# EAGLE schematic HDA-v1.1 (EAGLE 8.2.1)
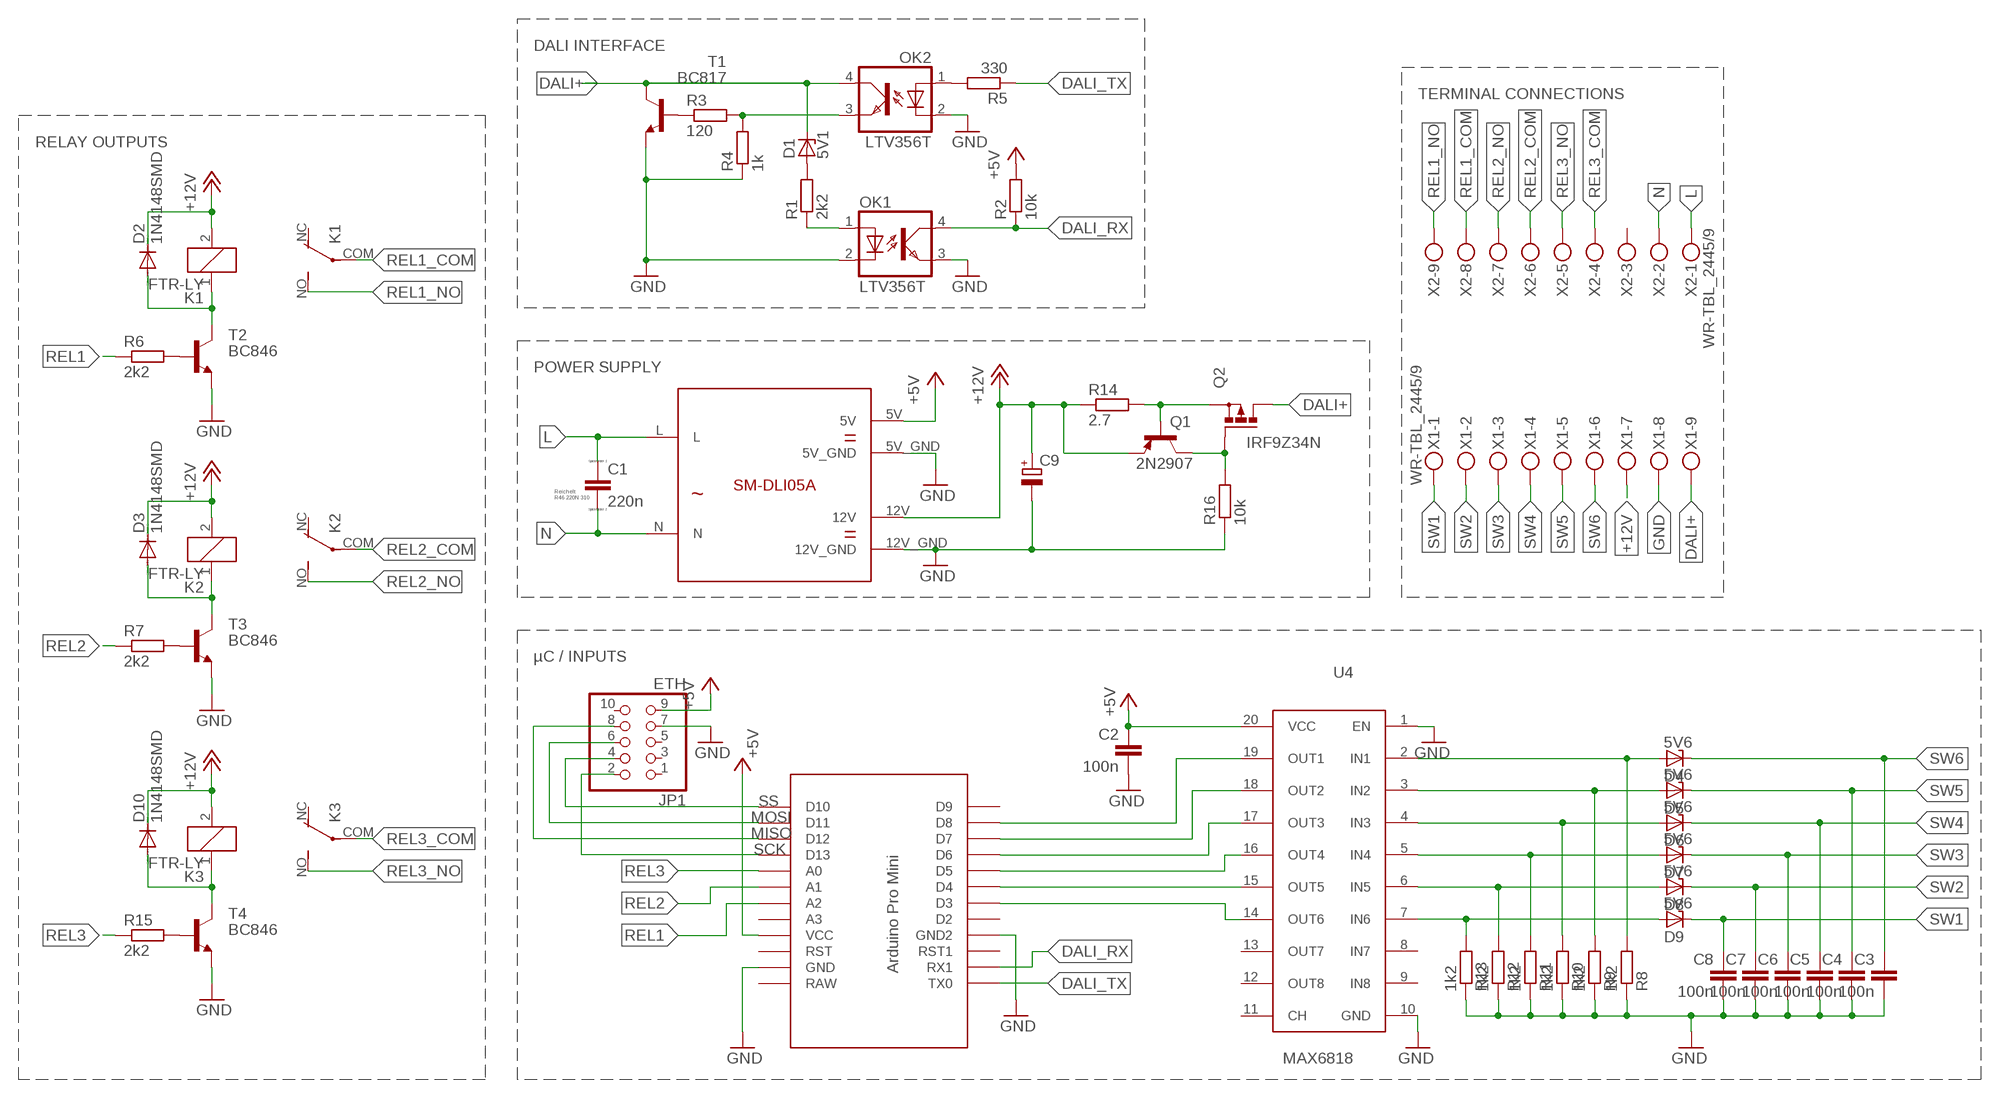
[diagram p0: schematic, sheet 1]

## Parts
C1  220n  X2_220N  [ECQUAAF224]
C2  100n  C-EUC1206K  [C1206K]
C3  100n  C-EUC1206K  [C1206K]
C4  100n  C-EUC1206K  [C1206K]
C5  100n  C-EUC1206K  [C1206K]
C6  100n  C-EUC1206K  [C1206K]
C7  100n  C-EUC1206K  [C1206K]
C8  100n  C-EUC1206K  [C1206K]
C9  CPOL-EUSMCE  [SMC_E]
D1  5V1  ZENER-DIODESOD80C  [SOD80C]
D2  1N4148SMD  DIODE-SOD80C  [SOD80C]
D3  1N4148SMD  DIODE-SOD80C  [SOD80C]
D4  5V6  ZENER-DIODESOD80C  [SOD80C]
D5  5V6  ZENER-DIODESOD80C  [SOD80C]
D6  5V6  ZENER-DIODESOD80C  [SOD80C]
D7  5V6  ZENER-DIODESOD80C  [SOD80C]
D8  5V6  ZENER-DIODESOD80C  [SOD80C]
D9  5V6  ZENER-DIODESOD80C  [SOD80C]
D10  1N4148SMD  DIODE-SOD80C  [SOD80C]
JP1  ETH  PINHD-2X5  [2X05]
K1  FTR-LY  PE3004H  [PE-FORM-C]
K2  FTR-LY  PE3004H  [PE-FORM-C]
K3  FTR-LY  PE3004H  [PE-FORM-C]
OK1  LTV356T  [SOP-4-2.54]
OK2  LTV356T  [SOP-4-2.54]
Q1  2N2907  MMBT2907ALT1SMD  [SOT23-BEC]
Q2  IRF9Z34N  PMOSFET_PTO220BV  [TO220BV]
R1  2k2  R-EU_R1206  [R1206]
R2  10k  R-EU_R1206  [R1206]
R3  120  R-EU_R1206  [R1206]
R4  1k  R-EU_R1206  [R1206]
R5  330  R-EU_R1206  [R1206]
R6  2k2  R-EU_R1206  [R1206]
R7  2k2  R-EU_R1206  [R1206]
R8  1k2  R-EU_R1206  [R1206]
R9  1k2  R-EU_R1206  [R1206]
R10  1k2  R-EU_R1206  [R1206]
R11  1k2  R-EU_R1206  [R1206]
R12  1k2  R-EU_R1206  [R1206]
R13  1k2  R-EU_R1206  [R1206]
R14  2.7  R-EU_R1206  [R1206]
R15  2k2  R-EU_R1206  [R1206]
R16  10k  R-EU_R1206  [R1206]
T1  BC817  BC817-40SMD  [SOT23-BEC]
T2  BC846  [SOT23]
T3  BC846  [SOT23]
T4  BC846  [SOT23]
U1  SM-DLI05A  [SM-DLI05A]
U2  ABK-PRO-MINI  [ABK-PRO-MINI]
U4  MAX6818  [SSOP20]
X1  WR-TBL_2445/9  [WR-TBL_2445/9]
X2  WR-TBL_2445/9  [WR-TBL_2445/9]

## Nets
+5V: C2.1 JP1.9 R2.2 U1.5V U2.VCC U4.20(VCC)
+12V: C9.+ D2.C D3.C D10.C K1.2 K2.2 K3.2 Q1.E R14.1 U1.12V X1.7
DALI+: D1.C OK2.4(COL) Q2.D T1.C X1.9
DALI_RX: OK1.4(COL) R2.1 U2.RX1
DALI_TX: R5.1 U2.TX0
GND: C2.2 C3.2 C4.2 C5.2 C6.2 C7.2 C8.2 C9.- JP1.7 OK1.2(C) OK1.3(EMIT) OK2.2(C) R4.1 R8.1 R9.1 R10.1 R11.1 R12.1 R13.1 R16.1 T1.E T2.2(E) T3.2(E) T4.2(E) U1.5V_GND U1.12V_GND U2.GND U2.GND1(GND2) U4.1(EN) U4.10(GND) X1.8
L: C1.1 U1.L X2.1
MISO: JP1.8 U2.D12
MOSI: JP1.6 U2.D11
N: C1.2 U1.N X2.2
N$1: D1.A R1.2
N$2: OK1.1(A) R1.1
N$3: Q1.B Q2.S R14.2
N$5: R3.1 T1.B
N$6: OK2.3(EMIT) R3.2 R4.2
N$7: Q1.C Q2.G R16.2
N$11: OK2.1(A) R5.2
N$19: R15.2 T4.1(B)
N$20: R6.2 T2.1(B)
N$21: R7.2 T3.1(B)
N$22: D3.A K2.1 T3.3(C)
N$23: D8.A R12.2 U4.6(IN5)
N$24: D2.A K1.1 T2.3(C)
N$25: D9.A R13.2 U4.7(IN6)
N$26: D4.A R8.2 U4.2(IN1)
N$27: D5.A R9.2 U4.3(IN2)
N$28: D6.A R10.2 U4.4(IN3)
N$29: D7.A R11.2 U4.5(IN4)
N$30: D10.A K3.1 T4.3(C)
N$31: U2.D5 U4.16(OUT4)
N$32: U2.D6 U4.17(OUT3)
N$33: U2.D7 U4.18(OUT2)
N$34: U2.D8 U4.19(OUT1)
N$35: U2.D4 U4.15(OUT5)
N$36: U2.D3 U4.14(OUT6)
REL1: R6.1 U2.A2
REL1_COM: K1.COM(2:P) X2.8
REL1_NO: K1.NO(2:S) X2.9
REL2: R7.1 U2.A1
REL2_COM: K2.COM(2:P) X2.6
REL2_NO: K2.NO(2:S) X2.7
REL3: R15.1 U2.A0
REL3_COM: K3.COM(2:P) X2.4
REL3_NO: K3.NO(2:S) X2.5
SCK: JP1.2 U2.D13
SS: JP1.4 U2.D10
SW1: C8.1 D9.C X1.1
SW2: C7.1 D8.C X1.2
SW3: C6.1 D7.C X1.3
SW4: C5.1 D6.C X1.4
SW5: C4.1 D5.C X1.5
SW6: C3.1 D4.C X1.6
Unconnected: JP1.1 JP1.3 JP1.5 JP1.10 K1.NC(2:O) K2.NC(2:O) K3.NC(2:O) U2.A3 U2.D2 U2.D9 U2.RAW U2.RST U2.RST1 U4.8(IN7) U4.9(IN8) U4.11(CH) U4.12(OUT8) U4.13(OUT7) X2.3

## Notes on the sheet
- DALI INTERFACE
- TERMINAL CONNECTIONS
- RELAY OUTPUTS
- POWER SUPPLY
- Reichelt:
  R46 220N 310
- µC / INPUTS

## Library data of the parts
C1 = bauteile:X2_220N
C2-C8 = resistor:C-EU: CAPACITOR, European symbol
C9 = resistor:CPOL-EU: POLARIZED CAPACITOR, European symbol
D1 D4-D9 = diode:ZENER-DIODE: Z-Diode
D2 D3 D10 = diode:DIODE-: DIODE
JP1 = pinhead:PINHD-2X5: PIN HEADER
K1-K3 = bauteile:PE30?*: SLIM POWER Relay NAiS Source: http://www.mew-europe.com/.. en_ds_61122_0000.pdf; MPN: APE3004H; OC_FARNELL: unknown; OC_NEWARK: 55M0343
OK1 OK2 = bauteile:LTV356T
Q1 = transistor-pnp:MMBT2907*: PNP Transistror
Q2 = transistor-power:PMOSFET_P: Power MOSFET P-Channel
R1-R16 = resistor:R-EU_: RESISTOR, European symbol
T1 = transistor-npn:BC817*: NPN Transistor
T2-T4 = transistor-neu-to92:BC846: NPN TRANSISTOR
U1 = bauteile:SM-DLI05A: SANMIM SM-DLI05A Dual Power Supply Module 5W 5V/500mA 12V/250mA http://www.sanmim.com/products_detail/productId=104.html
U2 = bauteile:ABK-PRO-MINI: ABK Pro-Mini Arduino Clone
U4 = Max68x:MAX6818
X1 X2 = bauteile:WR-TBL_2445/9: WÜRTH ELEKTRONIK Terminal Block Serie 2445 - 5.08 horizontal cable entry with rising cage clamp - WR-TBL WERI PART NO: 691 244 510 0xx